# EAGLE board FTHR-Modified Schematic (EAGLE 9.6.2)
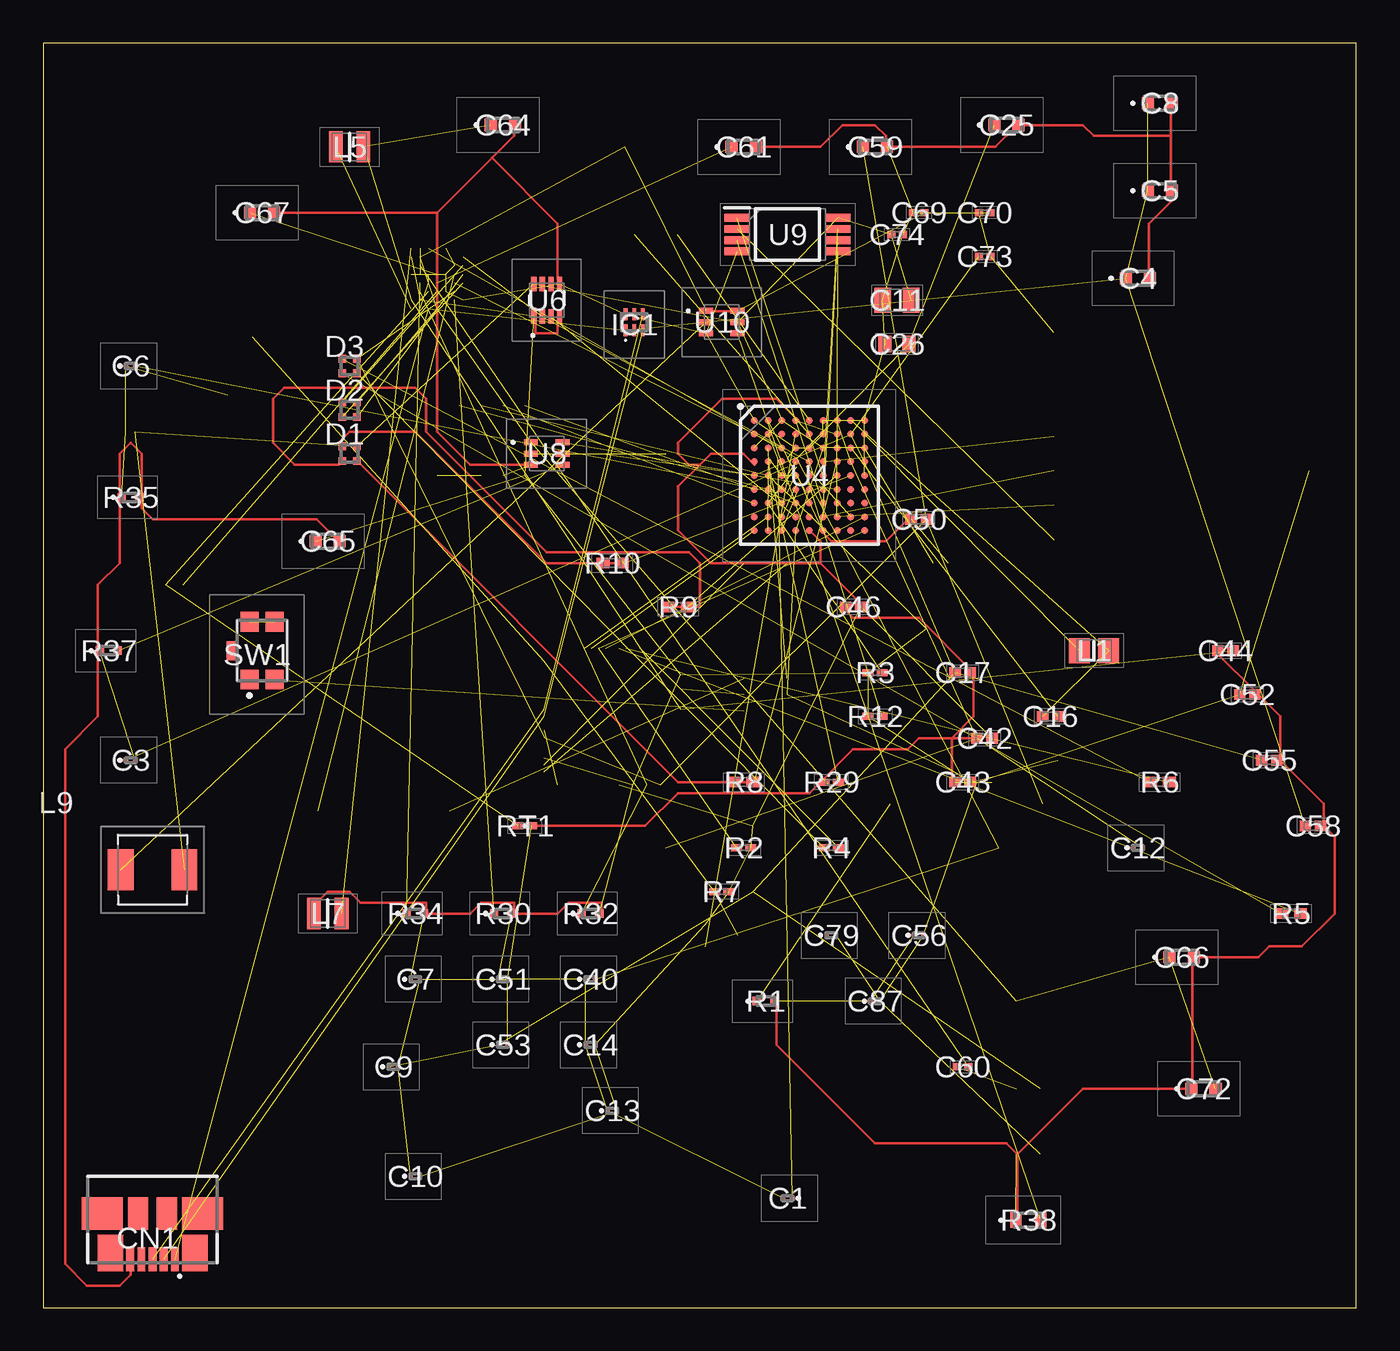
[diagram p3: board, top side]
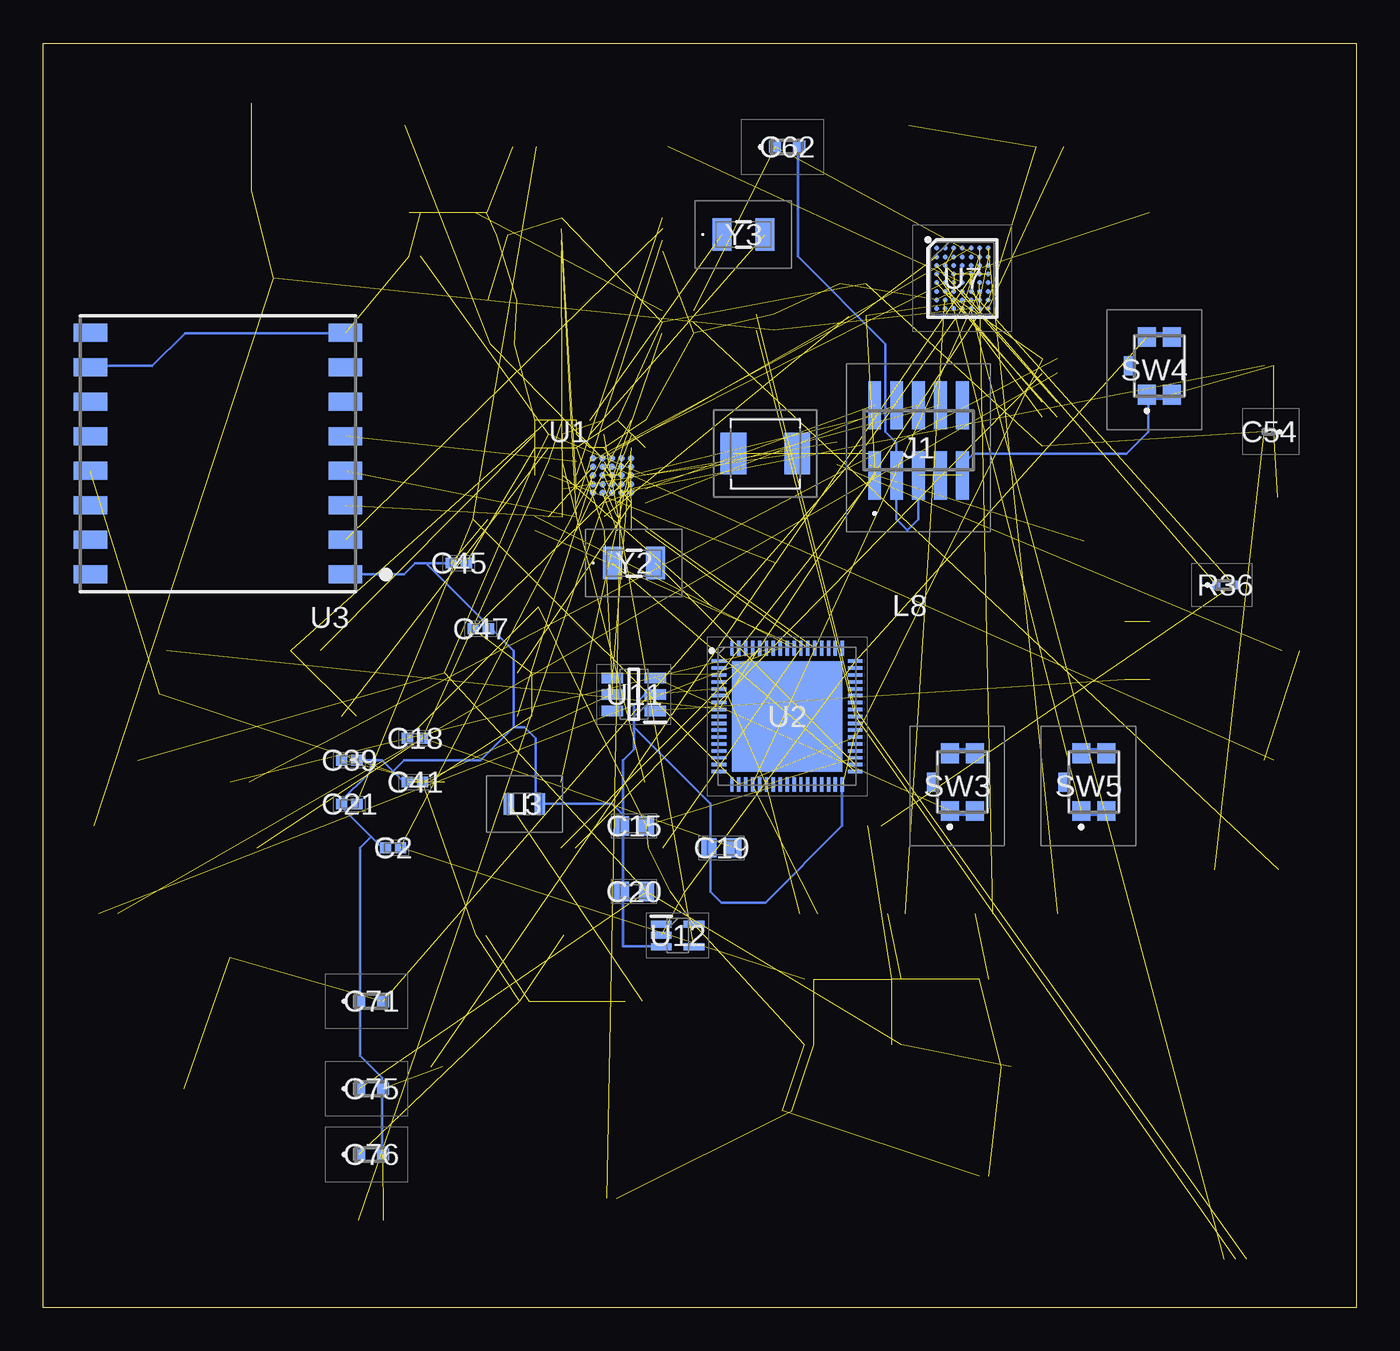
[diagram p4: board, bottom side, seen from below]

Size 76.18 x 73.33 mm. Coordinates in mm from the lower left corner, seen from the top.
Outline: 0,0 76.18,0 76.18,73.33 0,73.33 0,0
Copper layers ([2:[3:[14:1+2*3+4*13+14*15+16:3]:14]:15]): Top 0.035mm / dielectric 1.5mm / Route2 0.035mm / dielectric 0.15mm / Route3 0.035mm / dielectric 0.2mm / Route4 0.035mm / dielectric 0.15mm / Route13 0.035mm / dielectric 0.2mm / Route14 0.035mm / dielectric 0.15mm / Route15 0.035mm / dielectric 0.2mm / Bottom 0.035mm
Design rules "default *": minimum track width 6mil, minimum drill 12mm, track to track 6mil, track to pad 6mil, pad to pad 2mil, via to via 6mil, smd to smd 6mil, copper to edge 40mil, drill to drill 6mil, minimum pad ring 10mil, minimum via ring 8mil, stop-mask expansion 4mil, vias tented up to drill 0mil, thermal gap 10mil

## Footprints (pad centres in the part's own frame; a part is rotated, then mirrored left to right if it is on the bottom)
C0603_COMMERCIAL = smd 0.25 x 0.3: 1 -0.275,0; 2 0.275,0
CAPC1005X55N = smd 0.65 x 0.62: 1 -0.44,0; 2 0.44,0
C1608_COMMERCIAL = smd 0.7 x 0.7: 1 -0.7,0; 2 0.7,0
CAPC2012X145N = smd 0.97 x 1.47: 1 -0.83,0; 2 0.83,0
CAPC1608X80N = smd 0.87 x 1.12: 1 -0.72,0; 2 0.72,0
CAPC1608X90N = smd 0.75 x 0.94: 1 -0.7,0; 2 0.7,0
CAPC0603X33N = smd 0.465 x 0.42: 1 -0.332,0; 2 0.332,0
47346-0001 = smd 0.45 x 1.38: 1 1.3,-4.81; 2 0.65,-4.81; 3 0,-4.81; 4 -0.65,-4.81; 5 -1.3,-4.81 | smd 1.475 x 2.1: 6 -2.453,-4.45; 7 2.453,-4.45 | smd 1.175 x 1.9: 8 0.838,-2.15; 9 -0.838,-2.15 | smd 2.375 x 1.9: 10 2.913,-2.15; 11 -2.913,-2.15
SML-LX0404SIUPGUSB = smd 0.45 x 0.45: 1 0.425,0.425; 2 0.425,-0.425; 3 -0.425,-0.425; 4 -0.425,0.425
MAX13202EALT = smd 0.22 x 0.7: 1 -0.5,-0.46; 2 0,-0.46; 3 0.5,-0.46; 4 0.5,0.46; 5 0,0.46; 6 -0.5,0.46
FTSH10501LDVK = smd 0.74 x 2.79: 1 -2.54,0; 2 -2.54,4.07; 3 -1.27,0; 4 -1.27,4.07; 5 0,0; 6 0,4.07; 7 1.27,0; 8 1.27,4.07; 9 2.54,0; 10 2.54,4.07
INDC2012X105N = smd 1.2 x 1.45: 1 -0.85,0; 2 0.85,0
BLM21AG102BH1J = smd 0.6 x 1.25: 1 -0.9,0; 2 0.9,0
1286ASH1R0MP2 = smd 0.8 x 1.8: 1 -0.8,0; 2 0.8,0
WE-LHMI_402048 = smd 1.5 x 2.4: 1 -1.85,0; 2 1.85,0
ERJ2R_(0402) = smd 0.475 x 0.5: 1 -0.512,0; 2 0.512,0
RESC0603X28N = smd 0.625 x 0.4: 1 -0.412,0; 2 0.412,0
RESC0603X26N = smd 0.625 x 0.4: 1 -0.412,0; 2 0.412,0
RESC1005X40N = smd 0.75 x 0.6: 1 -0.55,0; 2 0.55,0
ERJ3EK_(0603) = smd 0.65 x 0.9: 1 -0.725,0; 2 0.725,0
THRMC0603X33N = smd 0.65 x 0.4: 1 -0.4,0; 2 0.4,0
EVPAA102K = smd 1.05 x 1.15: 1 -0.725,-1.675; 2 0.725,-1.675; 3 -0.725,1.675; 4 0.725,1.675 | smd 0.6 x 1.1: 5 -1.75,0
BGA25C50P5X5_347000X295000X276 = smd 0.383 x 0.383: A1 -1.1,1; A2 -0.55,1; A3 0,1; A4 0.55,1; A5 1.1,1; B1 -1.1,0.5; B2 -0.55,0.5; B3 0,0.5; B4 0.55,0.5; B5 1.1,0.5; C1 -1.1,0; C2 -0.55,0; C3 0,0; C4 0.55,0; C5 1.1,0; D1 -1.1,-0.5; D2 -0.55,-0.5; D3 0,-0.5; D4 0.55,-0.5; D5 1.1,-0.5; E1 -1.1,-1; E2 -0.55,-1; E3 0,-1; E4 0.55,-1; E5 1.1,-1
QFN40P800X800X80-69N = smd 0.85 x 0.2: 1 -3.95,3.2; 2 -3.95,2.8; 3 -3.95,2.4; 4 -3.95,2; 5 -3.95,1.6; 6 -3.95,1.2; 7 -3.95,0.8; 8 -3.95,0.4; 9 -3.95,0; 10 -3.95,-0.4; 11 -3.95,-0.8; 12 -3.95,-1.2; 13 -3.95,-1.6; 14 -3.95,-2; 15 -3.95,-2.4; 16 -3.95,-2.8; 17 -3.95,-3.2; 35 3.95,-3.2; 36 3.95,-2.8; 37 3.95,-2.4; 38 3.95,-2; 39 3.95,-1.6; 40 3.95,-1.2; 41 3.95,-0.8; 42 3.95,-0.4; 43 3.95,0; 44 3.95,0.4; 45 3.95,0.8; 46 3.95,1.2; 47 3.95,1.6; 48 3.95,2; 49 3.95,2.4; 50 3.95,2.8; 51 3.95,3.2 | smd 0.2 x 0.85: 18 -3.2,-3.95; 19 -2.8,-3.95; 20 -2.4,-3.95; 21 -2,-3.95; 22 -1.6,-3.95; 23 -1.2,-3.95; 24 -0.8,-3.95; 25 -0.4,-3.95; 26 0,-3.95; 27 0.4,-3.95; 28 0.8,-3.95; 29 1.2,-3.95; 30 1.6,-3.95; 31 2,-3.95; 32 2.4,-3.95; 33 2.8,-3.95; 34 3.2,-3.95; 52 3.2,3.95; 53 2.8,3.95; 54 2.4,3.95; 55 2,3.95; 56 1.6,3.95; 57 1.2,3.95; 58 0.8,3.95; 59 0.4,3.95; 60 0,3.95; 61 -0.4,3.95; 62 -0.8,3.95; 63 -1.2,3.95; 64 -1.6,3.95; 65 -2,3.95; 66 -2.4,3.95; 67 -2.8,3.95; 68 -3.2,3.95 | smd 6.4 x 6.4: 69 0,0
XCVR_RFM95W-868S2 = smd 1.95 x 1.05: 1 -7.4,7; 2 -7.4,5; 3 -7.4,3; 4 -7.4,1; 5 -7.4,-1; 6 -7.4,-3; 7 -7.4,-5; 8 -7.4,-7; 9 7.4,-7; 10 7.4,-5; 11 7.4,-3; 12 7.4,-1; 13 7.4,1; 14 7.4,3; 15 7.4,5; 16 7.4,7
BGA81C80P9X9_800X800X130 = smd 0.41 x 0.41: A1 -3.2,3.2; A2 -2.4,3.2; A3 -1.6,3.2; A4 -0.8,3.2; A5 0,3.2; A6 0.8,3.2; A7 1.6,3.2; A8 2.4,3.2; A9 3.2,3.2; B1 -3.2,2.4; B2 -2.4,2.4; B3 -1.6,2.4; B4 -0.8,2.4; B5 0,2.4; B6 0.8,2.4; B7 1.6,2.4; B8 2.4,2.4; B9 3.2,2.4; C1 -3.2,1.6; C2 -2.4,1.6; C3 -1.6,1.6; C4 -0.8,1.6; C5 0,1.6; C6 0.8,1.6; C7 1.6,1.6; C8 2.4,1.6; C9 3.2,1.6; D1 -3.2,0.8; D2 -2.4,0.8; D3 -1.6,0.8; D4 -0.8,0.8; D5 0,0.8; D6 0.8,0.8; D7 1.6,0.8; D8 2.4,0.8; D9 3.2,0.8; E1 -3.2,0; E2 -2.4,0; E3 -1.6,0; E4 -0.8,0; E5 0,0; E6 0.8,0; E7 1.6,0; E8 2.4,0; E9 3.2,0; F1 -3.2,-0.8; F2 -2.4,-0.8; F3 -1.6,-0.8; F4 -0.8,-0.8; F5 0,-0.8; F6 0.8,-0.8; F7 1.6,-0.8; F8 2.4,-0.8; F9 3.2,-0.8; G1 -3.2,-1.6; G2 -2.4,-1.6; G3 -1.6,-1.6; G4 -0.8,-1.6; G5 0,-1.6; G6 0.8,-1.6; G7 1.6,-1.6; G8 2.4,-1.6; G9 3.2,-1.6; H1 -3.2,-2.4; H2 -2.4,-2.4; H3 -1.6,-2.4; H4 -0.8,-2.4; H5 0,-2.4; H6 0.8,-2.4; H7 1.6,-2.4; H8 2.4,-2.4; H9 3.2,-2.4; J1 -3.2,-3.2; J2 -2.4,-3.2; J3 -1.6,-3.2; J4 -0.8,-3.2; J5 0,-3.2; J6 0.8,-3.2; J7 1.6,-3.2; J8 2.4,-3.2; J9 3.2,-3.2
MAX14595ETA = smd 0.3 x 0.95: 1 -0.75,-0.9 | smd 0.3 x 0.85: 2 -0.25,-0.95; 3 0.25,-0.95; 4 0.75,-0.95; 5 0.75,0.95; 6 0.25,0.95; 7 -0.25,0.95; 8 -0.75,0.95
BGA56C50P7X8_368X418X69 = smd 0.298 x 0.298: A1 -1.5,1.75; A2 -1,1.75; A3 -0.5,1.75; A4 0,1.75; A5 0.5,1.75; A6 1,1.75; A7 1.5,1.75; B1 -1.5,1.25; B2 -1,1.25; B3 -0.5,1.25; B4 0,1.25; B5 0.5,1.25; B6 1,1.25; B7 1.5,1.25; C1 -1.5,0.75; C2 -1,0.75; C3 -0.5,0.75; C4 0,0.75; C5 0.5,0.75; C6 1,0.75; C7 1.5,0.75; D1 -1.5,0.25; D2 -1,0.25; D3 -0.5,0.25; D4 0,0.25; D5 0.5,0.25; D6 1,0.25; D7 1.5,0.25; E1 -1.5,-0.25; E2 -1,-0.25; E3 -0.5,-0.25; E4 0,-0.25; E5 0.5,-0.25; E6 1,-0.25; E7 1.5,-0.25; F1 -1.5,-0.75; F2 -1,-0.75; F3 -0.5,-0.75; F4 0,-0.75; F5 0.5,-0.75; F6 1,-0.75; F7 1.5,-0.75; G1 -1.5,-1.25; G2 -1,-1.25; G3 -0.5,-1.25; G4 0,-1.25; G5 0.5,-1.25; G6 1,-1.25; G7 1.5,-1.25; H1 -1.5,-1.75; H2 -1,-1.75; H3 -0.5,-1.75; H4 0,-1.75; H5 0.5,-1.75; H6 1,-1.75; H7 1.5,-1.75
MAX38642AELTT = smd 0.8 x 0.35: 1 -0.915,0.65; 2 -0.915,0; 3 -0.915,-0.65; 4 0.915,-0.65; 5 0.915,0; 6 0.915,0.65
SOP65P640X110-8N = smd 1.45 x 0.45: 1 -2.925,0.975; 2 -2.925,0.325; 3 -2.925,-0.325; 4 -2.925,-0.975; 5 2.925,-0.975; 6 2.925,-0.325; 7 2.925,0.325; 8 2.925,0.975
SOT95P280X145-6N = smd 1.25 x 0.6: 1 -1.25,0.95; 2 -1.25,0; 3 -1.25,-0.95; 4 1.25,-0.95; 5 1.25,0; 6 1.25,0.95
SOT65P210X110-5N = smd 1.2 x 0.4: 1 -0.95,0.65; 2 -0.95,0; 3 -0.95,-0.65; 4 0.95,-0.65; 5 0.95,0.65
ABS0732768KHZ6T = smd 1.1 x 1.9: 1 -1.25,0; 2 1.25,0

## Placement (x,y rotation side)
C1  C0603X5R1C104K030BC  [C0603_COMMERCIAL]  43.18,6.35 180 top
C2  C0402C105K8PAC  [CAPC1005X55N]  55.88,26.67 0 bottom
C3  C0603X5R1C104K030BC  [C0603_COMMERCIAL]  5.08,31.75 0 top
C4  C1608X5R1V105K080AB  [C1608_COMMERCIAL]  63.5,59.69 0 top
C5  C1608X8R1E104K080AA  [C1608_COMMERCIAL]  64.77,64.77 0 top
C6  C0603X5R1C104K030BC  [C0603_COMMERCIAL]  5.08,54.61 0 top
C7  C0603X5R1C104K030BC  [C0603_COMMERCIAL]  21.59,19.05 0 top
C8  C1608X5R1V105K080AB  [C1608_COMMERCIAL]  64.77,69.85 0 top
C9  C0603X5R1C104K030BC  [C0603_COMMERCIAL]  20.32,13.97 0 top
C10  C0603X5R1C104K030BC  [C0603_COMMERCIAL]  21.59,7.62 0 top
C11  GRM21BR61A476ME15K  [CAPC2012X145N]  49.53,58.42 0 top
C12  C0603X5R1C104K030BC  [C0603_COMMERCIAL]  63.5,26.67 0 top
C13  C0603X5R1C104K030BC  [C0603_COMMERCIAL]  33.02,11.43 0 top
C14  C0603X5R1C104K030BC  [C0603_COMMERCIAL]  31.75,15.24 0 top
C15  CL10A226MO7JZNC  [CAPC1608X80N]  41.91,27.94 0 bottom
C16  GRM155R71H332KA01J  [CAPC1005X55N]  58.42,34.29 0 top
C17  CC0402KRX5R6BB105  [CAPC1005X55N]  53.34,36.83 0 top
C18  CC0402KRX5R6BB105  [CAPC1005X55N]  54.61,33.02 0 bottom
C19  CL10A226MO7JZNC  [CAPC1608X80N]  36.83,26.67 0 bottom
C20  CL10A226MO7JZNC  [CAPC1608X80N]  41.91,24.13 0 bottom
C21  C0402C105K8PAC  [CAPC1005X55N]  58.42,29.21 0 bottom
C25  C1608X5R1V105K080AB  [C1608_COMMERCIAL]  55.88,68.58 0 top
C26  GRM188R61A226ME15J  [CAPC1608X90N]  49.53,55.88 0 top
C39  C0402C105K8PAC  [CAPC1005X55N]  58.42,31.75 0 bottom
C40  C0603X5R1C104K030BC  [C0603_COMMERCIAL]  31.75,19.05 0 top
C41  CC0402KRX5R6BB105  [CAPC1005X55N]  54.61,30.48 0 bottom
C42  CC0402KRX5R6BB105  [CAPC1005X55N]  54.61,33.02 0 top
C43  CC0402KRX5R6BB105  [CAPC1005X55N]  53.34,30.48 0 top
C44  CC0402KRX5R6BB105  [CAPC1005X55N]  68.58,38.1 0 top
C45  C0402C105K8PAC  [CAPC1005X55N]  52.07,43.18 0 bottom
C46  C0402C105K8PAC  [CAPC1005X55N]  46.99,40.64 0 top
C47  C0402C105K8PAC  [CAPC1005X55N]  50.8,39.37 180 bottom
C50  C0402C105K8PAC  [CAPC1005X55N]  50.8,45.72 0 top
C51  C0603X5R1C104K030BC  [C0603_COMMERCIAL]  26.67,19.05 0 top
C52  CC0402KRX5R6BB105  [CAPC1005X55N]  69.85,35.56 0 top
C53  C0603X5R1C104K030BC  [C0603_COMMERCIAL]  26.67,15.24 0 top
C54  C0603X5R1C104K030BC  [C0603_COMMERCIAL]  5.08,50.8 180 bottom
C55  CC0402KRX5R6BB105  [CAPC1005X55N]  71.12,31.75 0 top
C56  C0603X5R1C104K030BC  [C0603_COMMERCIAL]  50.8,21.59 0 top
C58  CC0402KRX5R6BB105  [CAPC1005X55N]  73.66,27.94 0 top
C59  C1608X5R1V105K080AB  [C1608_COMMERCIAL]  48.26,67.31 0 top
C60  GRM033R61A105ME15W  [CAPC0603X33N]  53.34,13.97 0 top
C61  C1608X5R1V105K080AB  [C1608_COMMERCIAL]  40.64,67.31 0 top
C62  C1608X5R1V105K080AB  [C1608_COMMERCIAL]  33.02,67.31 0 bottom
C64  C1608X5R1V105K080AB  [C1608_COMMERCIAL]  26.67,68.58 0 top
C65  C1608X5R1V105K080AB  [C1608_COMMERCIAL]  16.51,44.45 0 top
C66  C1608X5R1V105K080AB  [C1608_COMMERCIAL]  66.04,20.32 0 top
C67  C1608X8R1E104K080AA  [C1608_COMMERCIAL]  12.7,63.5 0 top
C69  GRM033R61A105ME15W  [CAPC0603X33N]  50.8,63.5 0 top
C70  GRM033R61A105ME15W  [CAPC0603X33N]  54.61,63.5 0 top
C71  C1608X5R1V105K080AB  [C1608_COMMERCIAL]  57.15,17.78 0 bottom
C72  C1608X5R1V105K080AB  [C1608_COMMERCIAL]  67.31,12.7 0 top
C73  GRM033R61A105ME15W  [CAPC0603X33N]  54.61,60.96 0 top
C74  GRM033R61A105ME15W  [CAPC0603X33N]  49.53,62.23 0 top
C75  C1608X5R1V105K080AB  [C1608_COMMERCIAL]  57.15,12.7 0 bottom
C76  C1608X5R1V105K080AB  [C1608_COMMERCIAL]  57.15,8.89 0 bottom
C79  C0603X5R1A104K030BC  [C0603_COMMERCIAL]  45.72,21.59 0 top
C87  C0603X5R1A104K030BC  [C0603_COMMERCIAL]  48.26,17.78 0 top
CN1  47346-0001  [47346-0001]  6.35,7.62 0 top
D1  SML-LX0404SIUPGUSB  [SML-LX0404SIUPGUSB]  17.78,49.53 0 top
D2  SML-LX0404SIUPGUSB  [SML-LX0404SIUPGUSB]  17.78,52.07 0 top
D3  SML-LX0404SIUPGUSB  [SML-LX0404SIUPGUSB]  17.78,54.61 0 top
IC1  MAX13202EALT+  [MAX13202EALT]  34.29,57.15 0 top
J1  FTSH-105-01-L-DV-K  [FTSH10501LDVK]  25.4,48.26 0 bottom
L1  MLP2012H2R2MT0S1  [INDC2012X105N]  60.96,38.1 0 top
L3  BLM21PG221SN1J  [BLM21AG102BH1J]  48.26,29.21 0 bottom
L5  DFE201612E-2R2M=P2  [1286ASH1R0MP2]  17.78,67.31 0 top
L7  DFE201612E-2R2M=P2  [1286ASH1R0MP2]  16.51,22.86 0 top
L8  74437324022  [WE-LHMI_402048]  34.29,49.53 0 bottom
L9  74437324022  [WE-LHMI_402048]  6.35,25.4 0 top
R1  ERJ-2RKF1004X  [ERJ2R_(0402)]  41.91,17.78 0 top
R2  CRCW0201100KFKED  [RESC0603X28N]  40.64,26.67 0 top
R3  ERJ-1GEF2201C  [RESC0603X26N]  48.26,36.83 0 top
R4  CRCW0201100KFKED  [RESC0603X28N]  45.72,26.67 0 top
R5  CRCW04021K40FKED  [RESC1005X40N]  72.39,22.86 0 top
R6  CRCW04021K00FKED  [RESC1005X40N]  64.77,30.48 0 top
R7  CRCW020110K0FKED  [RESC0603X28N]  39.37,24.13 0 top
R8  CRCW04022K70FKED  [RESC1005X40N]  40.64,30.48 0 top
R9  CRCW04021K40FKED  [RESC1005X40N]  36.83,40.64 0 top
R10  CRCW04021K40FKED  [RESC1005X40N]  33.02,43.18 0 top
R12  ERJ-1GEF2201C  [RESC0603X26N]  48.26,34.29 0 top
R29  CRCW0201100KFKED  [RESC0603X28N]  45.72,30.48 0 top
R30  ERJ-2RKF1002X  [ERJ2R_(0402)]  26.67,22.86 0 top
R32  ERJ-2RKF1002X  [ERJ2R_(0402)]  31.75,22.86 0 top
R34  ERJ-2RKF1002X  [ERJ2R_(0402)]  21.59,22.86 0 top
R35  ERJ-2RKF3833X  [ERJ2R_(0402)]  5.08,46.99 0 top
R36  ERJ-2RKF1002X  [ERJ2R_(0402)]  7.62,41.91 0 bottom
R37  ERJ-2RKF3833X  [ERJ2R_(0402)]  3.81,38.1 0 top
R38  ERJ3EKF5622V  [ERJ3EK_(0603)]  57.15,5.08 0 top
RT1  NCP03XH103J05RL  [THRMC0603X33N]  27.94,27.94 0 top
SW1  EVP-AA102K  [EVPAA102K]  12.7,38.1 0 top
SW3  EVP-AA102K  [EVPAA102K]  22.86,30.48 0 bottom
SW4  EVP-AA102K  [EVPAA102K]  11.43,54.61 0 bottom
SW5  EVP-AA102K  [EVPAA102K]  15.24,30.48 0 bottom
U1  OVM7692-RYAA  [BGA25C50P5X5_347000X295000X276]  43.18,48.26 0 bottom
U2  MAX32625ITK+  [QFN40P800X800X80-69N]  33.02,34.29 0 bottom
U3  RFM95W-868S2  [XCVR_RFM95W-868S2]  66.04,49.53 180 bottom
U4  MAX78000EXG+  [BGA81C80P9X9_800X800X130]  44.45,48.26 0 top
U6  MAX14595ETA+  [MAX14595ETA]  29.21,58.42 0 top
U7  MAX20303BEWN+  [BGA56C50P7X8_368X418X69]  22.86,59.69 0 bottom
U8  MAX38642AELT+T  [MAX38642AELTT]  29.21,49.53 0 top
U9  N01S830HAT22I  [SOP65P640X110-8N]  43.18,62.23 0 top
U10  MAX38642AELT+T  [MAX38642AELTT]  39.37,57.15 0 top
U11  MAX6817EUT+T  [SOT95P280X145-6N]  41.91,35.56 180 bottom
U12  SN74LVC1G07DCKR  [SOT65P210X110-5N]  39.37,21.59 0 bottom
Y2  ABS07-32.768KHZ-6-T  [ABS0732768KHZ6T]  41.91,43.18 0 bottom
Y3  ABS07-32.768KHZ-6-T  [ABS0732768KHZ6T]  35.56,62.23 0 bottom

## Tracks (layer width: path | path; a pad name or v marks a point on that pad's centre or on a via)
1V2  (4 unrouted)
1V8  (16 unrouted)
  Top 0.152: 22.23,22.86 22.23,23.5 18.41,23.5 17.78,24.13 16.51,24.13 15.88,23.5 15.88,22.86 L7.1 | 27.3,22.86 27.3,23.5 25.4,23.5 24.77,22.86 22.23,22.86 | 22.23,22.86 R34.2 | 27.3,22.86 29.84,22.86 30.48,23.5 32.38,23.5 32.38,22.86 R32.2 | 27.3,22.86 R30.2 | U6.4 29.84,57.15 29.84,56.52 28.57,56.52 28.57,57.15 U6.1
2V8  (5 unrouted)
3V3_VREGI  (21 unrouted)
3V3_VUSB  (6 unrouted)
12C2_SCL  (1 unrouted)
B_LED  (1 unrouted)
DM  (2 unrouted)
DP  (2 unrouted)
EXTERNAL_RST  (3 unrouted)
  Bottom 0.152: SW4.3 12.06,56.52 10.79,56.52 SW4.4
G_LED  (1 unrouted)
GND  (56 unrouted)
  Top 0.152: 45.09,30.48 46.99,32.38 50.16,32.38 50.8,33.02 52.7,33.02 | C42.1 52.7,33.02 | RT1.2 34.92,27.94 36.83,29.84 44.45,29.84 45.09,30.48 | 45.09,30.48 R29.1 | 52.7,33.02 52.7,30.48 C43.1 | 53.98,36.83 53.98,34.29 52.7,33.02 | 53.98,36.83 50.8,40.01 46.99,40.01 46.35,40.64 C46.1 | 53.98,36.83 C17.2 | 3.17,38.1 3.17,41.91 4.45,43.18 4.45,46.99 | 5.71,46.99 5.71,49.53 5.08,50.16 4.45,49.53 4.45,46.99 | 4.45,46.99 R35.1 | 5.71,46.99 5.71,46.35 6.35,45.72 15.88,45.72 17.14,44.45 C65.2 | 5.71,46.99 R35.2 | 3.17,38.1 3.17,34.29 1.27,32.38 1.27,2.54 2.54,1.27 4.45,1.27 5.08,1.91 5.08,2.54 CN1.5 | 3.17,38.1 R37.1 | 22.86,63.5 C67.2 13.34,63.5 | 26.04,66.67 27.3,67.94 27.3,68.58 C64.2 | 26.04,66.67 22.86,63.5 | 22.86,63.5 22.86,50.8 24.77,48.9 27.94,48.9 U8.3 | 26.04,66.67 29.84,62.87 29.84,59.69 U6.5 | 71.75,31.75 71.75,34.29 70.48,35.56 | 74.3,27.94 74.3,29.21 71.75,31.75 | 71.75,31.75 C55.2 | 70.48,35.56 67.94,38.1 C44.1 | 70.48,35.56 C52.2 | 56.52,8.89 55.88,9.53 48.26,9.53 42.55,15.24 42.55,17.78 R1.2 | 56.52,8.89 56.52,5.08 R38.1 | 56.52,8.89 60.33,12.7 C72.1 66.67,12.7 66.67,20.32 C66.2 70.48,20.32 71.12,20.95 73.03,20.95 74.93,22.86 74.93,27.3 74.3,27.94 | 74.3,27.94 C58.2 | 65.41,64.77 65.41,64.14 64.14,62.87 64.14,59.69 C4.2 | 65.41,64.77 65.41,67.94 | 65.41,67.94 65.41,69.85 C8.2 | 65.41,64.77 C5.2 | 41.27,67.31 C61.2 45.09,67.31 46.35,68.58 48.26,68.58 48.9,67.94 48.9,67.31 C59.2 55.24,67.31 56.52,68.58 C25.2 60.33,68.58 60.96,67.94 65.41,67.94 | U4.J6 45.09,45.09 45.72,44.45 48.9,44.45 50.16,45.72 C50.1
  Bottom 0.152: 37.47,26.67 37.47,24.13 36.83,23.5 34.29,23.5 29.84,27.94 29.84,30.48 U2.34 | 53.98,43.18 50.16,39.37 | 53.98,43.18 54.61,43.18 55.24,42.55 58.42,42.55 U3.1 | 53.98,43.18 C45.1 | 56.52,12.7 56.52,8.89 C76.2 | 57.78,17.78 57.78,14.61 56.52,13.34 56.52,12.7 | 56.52,12.7 C75.2 | 55.88,31.11 56.52,31.75 57.15,31.75 | 55.88,31.11 55.24,30.48 C41.1 | C39.2 57.15,31.75 | 59.05,29.21 57.15,27.3 | 57.15,27.3 56.52,26.67 C2.1 | 57.15,31.75 57.15,31.11 59.05,29.21 | 59.05,29.21 C21.1 | 42.55,27.94 42.55,24.13 | 42.55,24.13 42.55,20.95 40.64,20.95 U12.3 | 42.55,24.13 C20.1 | 42.55,28.57 43.18,29.21 L3.2 47.62,29.21 47.62,33.02 48.26,33.66 48.9,33.66 | 42.55,27.94 42.55,28.57 | 42.55,27.94 C15.1 | 41.91,33.66 41.91,32.38 42.55,31.75 42.55,28.57 | 41.91,33.66 41.91,34.92 41.27,35.56 U11.2 | 55.88,31.11 55.24,31.75 50.8,31.75 48.9,33.66 | 57.78,17.78 57.78,26.67 57.15,27.3 | 57.78,17.78 C71.1 | 50.16,39.37 48.9,38.1 48.9,33.66 | 50.16,39.37 C47.1 | 37.47,26.67 37.47,29.21 41.91,33.66 | 37.47,26.67 C19.1 | 12.06,52.7 10.79,52.7 SW4.2 | 12.06,52.7 12.06,50.8 13.34,49.53 22.23,49.53 22.86,48.9 J1.9 | 12.06,52.7 SW4.1 | C62.2 32.38,67.31 32.38,60.96 27.3,55.88 27.3,50.8 26.67,50.16 J1.3 26.67,45.72 26.04,45.09 25.4,45.72 J1.5 | U3.8 59.05,56.52 67.94,56.52 69.85,54.61 73.03,54.61 U3.10
GND_CHASSIS  (1 unrouted)
I2C1_SCL  (2 unrouted)
I2C1_SDA  (1 unrouted)
I2C2_SDA  (2 unrouted)
I2S_SCK/RV_TDI  (1 unrouted)
I2S_SDI  (1 unrouted)
I2S_WS/RV_TDO  (1 unrouted)
N$1  (1 unrouted)
N$2
  Bottom 0.152: SW5.3 15.88,32.38 14.61,32.38 SW5.4
N$3  (1 unrouted)
N$4  (2 unrouted)
N$5  (1 unrouted)
N$6  (1 unrouted)
N$7  (1 unrouted)
N$8  (1 unrouted)
N$9  (1 unrouted)
N$10  (1 unrouted)
N$11  (1 unrouted)
N$12  (1 unrouted)
N$13  (1 unrouted)
N$14  (1 unrouted)
  Bottom 0.152: SW3.1 23.5,28.57 22.23,28.57 SW3.2
N$15  (2 unrouted)
N$16
  Bottom 0.152: SW3.3 23.5,32.38 22.23,32.38 SW3.4
N$17  (1 unrouted)
N$18  (1 unrouted)
N$19  (1 unrouted)
N$20  (1 unrouted)
N$21  (1 unrouted)
N$22  (1 unrouted)
N$23  (1 unrouted)
N$24  (2 unrouted)
N$25  (1 unrouted)
N$26  (1 unrouted)
N$27  (1 unrouted)
N$30  (1 unrouted)
N$31  (1 unrouted)
N$32  (1 unrouted)
P0_0_UART0_RX  (2 unrouted)
P0_1_UART0_TX  (1 unrouted)
P0_3_CAM_PDOWN  (1 unrouted)
P1_0_RV_TCK  (1 unrouted)
P1_1_RV_TMS  (1 unrouted)
P1_7_BUTTON_2  (1 unrouted)
P2_0_LED_R  (1 unrouted)
  Top 0.152: D1.2 36.83,30.48 R8.1 R8.2 41.27,30.48
P2_1_LED_G  (1 unrouted)
  Top 0.152: D1.4 17.14,50.16 17.78,50.8 21.59,50.8 29.21,43.18 R10.1 R10.2 33.66,43.18
P2_2_LED_B  (1 unrouted)
  Top 0.152: D1.3 17.14,48.9 14.61,48.9 13.34,50.16 13.34,52.7 13.97,53.34 21.59,53.34 22.23,52.7 22.23,50.8 29.21,43.81 37.47,43.81 38.1,43.18 38.1,40.64 R9.2 R9.1 36.2,40.64
P2_5_BOOST_EN  (1 unrouted)
PCIF_HSYNC  (1 unrouted)
PCIF_IO0  (1 unrouted)
PCIF_IO1  (1 unrouted)
PCIF_IO2  (1 unrouted)
PCIF_IO3  (1 unrouted)
PCIF_IO4  (1 unrouted)
PCIF_IO5  (1 unrouted)
PCIF_IO6  (1 unrouted)
PCIF_IO7  (1 unrouted)
PCIF_VSYNC  (1 unrouted)
PCIF_XCLK  (1 unrouted)
PCIF_XVCLK  (1 unrouted)
PMIC_ALRT_N  (1 unrouted)
PMIC_INT  (1 unrouted)
PMIC_LED0  (1 unrouted)
PMIC_LED1  (1 unrouted)
PMIC_LED2  (1 unrouted)
PMIC_PFN1  (1 unrouted)
  Bottom 0.152: SW5.1 15.88,28.57 14.61,28.57 SW5.2
PMIC_PFN2  (1 unrouted)
QSPI0_SDIO2  (1 unrouted)
QSPI0_SDIO3  (1 unrouted)
QSPI0_SS1  (1 unrouted)
R_LED  (1 unrouted)
RST_N  (2 unrouted)
SD_SPI_DI  (2 unrouted)
SD_SPI_DO  (1 unrouted)
SD_SPI_SCLK  (2 unrouted)
SRAM_CS  (1 unrouted)
SWDCLK  (1 unrouted)
SWDIO  (1 unrouted)
SYS_OUT  (11 unrouted)
  Top 0.152: U10.6 40.01,57.78 38.73,57.78 U10.1
VBUS  (6 unrouted)
VCOREA  (11 unrouted)
VREGO_A  (11 unrouted)
  Top 0.152: 45.09,43.18 47.62,40.64 C46.2 | 45.09,43.18 45.09,44.45 44.45,45.09 U4.J5 | 38.1,48.9 36.83,47.62 36.83,45.09 38.73,43.18 45.09,43.18 | 38.1,48.9 38.73,49.53 40.64,49.53 41.27,48.9 U4.D1 | 38.1,48.9 37.47,48.9 36.83,49.53 36.83,50.16 39.37,52.7 42.55,52.7 43.81,51.44 U4.A4
VREGO_B  (4 unrouted)